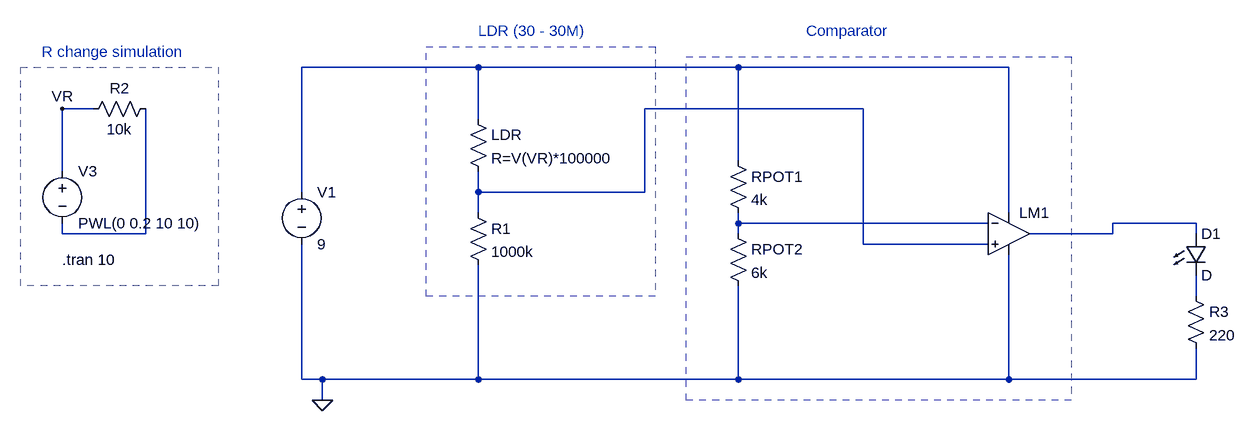
[diagram p0: schematic 3.orient.asc]
3.orient.asc, the LTspice schematic file:
Version 4.1
SHEET 1 2388 680
WIRE 496 -160 224 -160
WIRE 896 -160 496 -160
WIRE 1312 -160 896 -160
WIRE -96 -96 -144 -96
WIRE 1088 -96 752 -96
WIRE 496 -80 496 -160
WIRE 896 -16 896 -160
WIRE -144 0 -144 -96
WIRE 224 32 224 -160
WIRE 496 32 496 0
WIRE 752 32 752 -96
WIRE 752 32 496 32
WIRE 496 64 496 32
WIRE 1312 64 1312 -160
WIRE 896 80 896 64
WIRE 1280 80 896 80
WIRE 1600 80 1472 80
WIRE -144 96 -144 80
WIRE -16 96 -16 -96
WIRE -16 96 -144 96
WIRE 896 96 896 80
WIRE 1472 96 1472 80
WIRE 1472 96 1344 96
WIRE 1600 96 1600 80
WIRE 1088 112 1088 -96
WIRE 1280 112 1088 112
WIRE 1600 192 1600 160
WIRE 224 320 224 112
WIRE 256 320 224 320
WIRE 496 320 496 144
WIRE 496 320 256 320
WIRE 896 320 896 176
WIRE 896 320 496 320
WIRE 1312 320 1312 128
WIRE 1312 320 896 320
WIRE 1600 320 1600 272
WIRE 1600 320 1312 320
WIRE 256 352 256 320
FLAG 256 352 0
FLAG -144 -96 VR
SYMBOL voltage 224 16 R0
WINDOW 123 0 0 Left 0
WINDOW 39 0 0 Left 0
SYMATTR InstName V1
SYMATTR Value 9
SYMBOL OpAmps\\UniversalOpAmp2 1312 96 R0
SYMATTR InstName LM1
SYMATTR Value2 Avol=140k GBW=1.2Meg Slew=0.5Meg
SYMATTR SpiceLine Ilimit=40m Rail=0 Vos=2.5m
SYMATTR SpiceLine2 En=0 Enk=0 In=0 Ink=0 Rin=10Meg
SYMBOL res 1584 176 R0
SYMATTR InstName R3
SYMATTR Value 220
SYMBOL LED 1584 96 R0
SYMATTR InstName D1
SYMBOL res 480 -96 R0
SYMATTR InstName LDR
SYMATTR Value R=V(VR)*100000
SYMBOL res 480 48 R0
SYMATTR InstName R1
SYMATTR Value 1000k
SYMBOL voltage -144 -16 R0
WINDOW 123 0 0 Left 0
WINDOW 39 0 0 Left 0
SYMATTR InstName V3
SYMATTR Value PWL(0 0.2 10 10)
SYMBOL res 0 -112 R90
WINDOW 0 0 56 VBottom 2
WINDOW 3 32 56 VTop 2
SYMATTR InstName R2
SYMATTR Value 10k
SYMBOL res 880 -32 R0
SYMATTR InstName RPOT1
SYMATTR Value 4k
SYMBOL res 880 80 R0
SYMATTR InstName RPOT2
SYMATTR Value 6k
TEXT -144 136 Left 2 !.tran 10
TEXT 1000 -216 Left 2 ;Comparator
TEXT 496 -216 Left 2 ;LDR (30 - 30M)
TEXT -176 -184 Left 2 ;R change simulation
RECTANGLE Normal 1408 352 816 -176 2
RECTANGLE Normal 96 176 -208 -160 2
RECTANGLE Normal 768 192 416 -192 2

The netlist it stands for:
* 3.orient.asc
V1 N001 0 9
X§LM1 N002 N003 N001 0 N004 level2 Avol=140k GBW=1.2Meg Slew=0.5Meg Ilimit=40m Rail=0 Vos=2.5m En=0 Enk=0 In=0 Ink=0 Rin=10Meg  ; pins In+ In- V+ V- OUT
R3 N006 0 220
D1 N004 N006 D
R§LDR N001 N002 R=V(VR)*100000
R1 N002 0 1000k
V3 VR N005 PWL(0 0.2 10 10)
R2 N005 VR 10k
RPOT1 N001 N003 4k
RPOT2 N003 0 6k
.model D D
.lib standard.dio
.tran 10
* Comparator
* LDR (30 - 30M)
* R change simulation
.lib UniversalOpAmp2.lib
.backanno
.end